# Altium schematic sheet battery_protection.SchDoc: Battery Protection
size A4; Organization: Badgerloop Electrical; Address1: 133 Engineering Research Building; Address2: 1500 Engineering Drive; Address3: Madison, Wi 53706
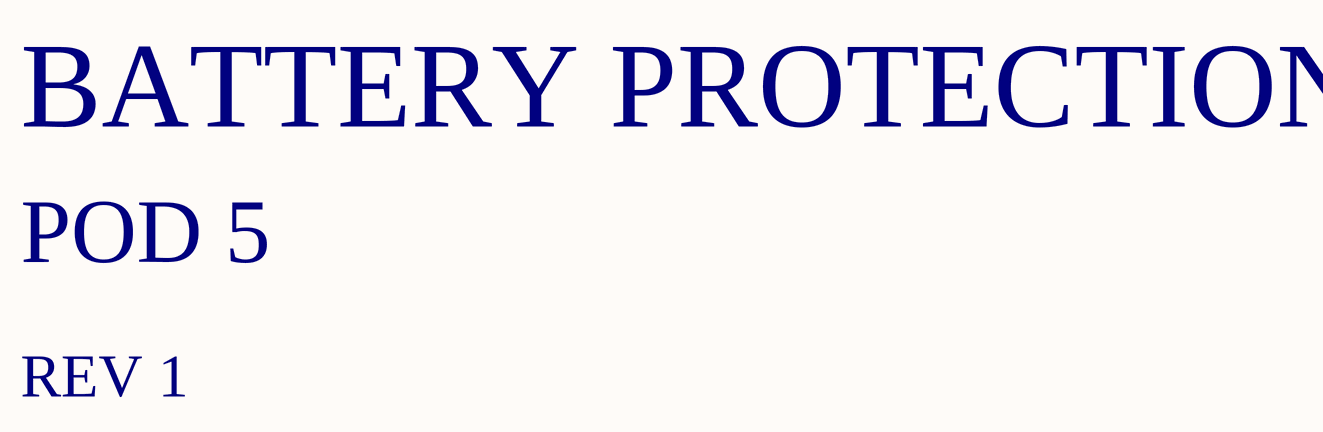
[diagram p0: battery_protection.SchDoc]

## Notes on the sheet
- BATTERY PROTECTION
- POD 5
- REV 1
- Title
- Engineer:
- Date:
- Time:
- Revision:
- Sheet
- of
- File: